# EAGLE design bpf-L-band-BPF-F1250+ (EAGLE 9.2.2)
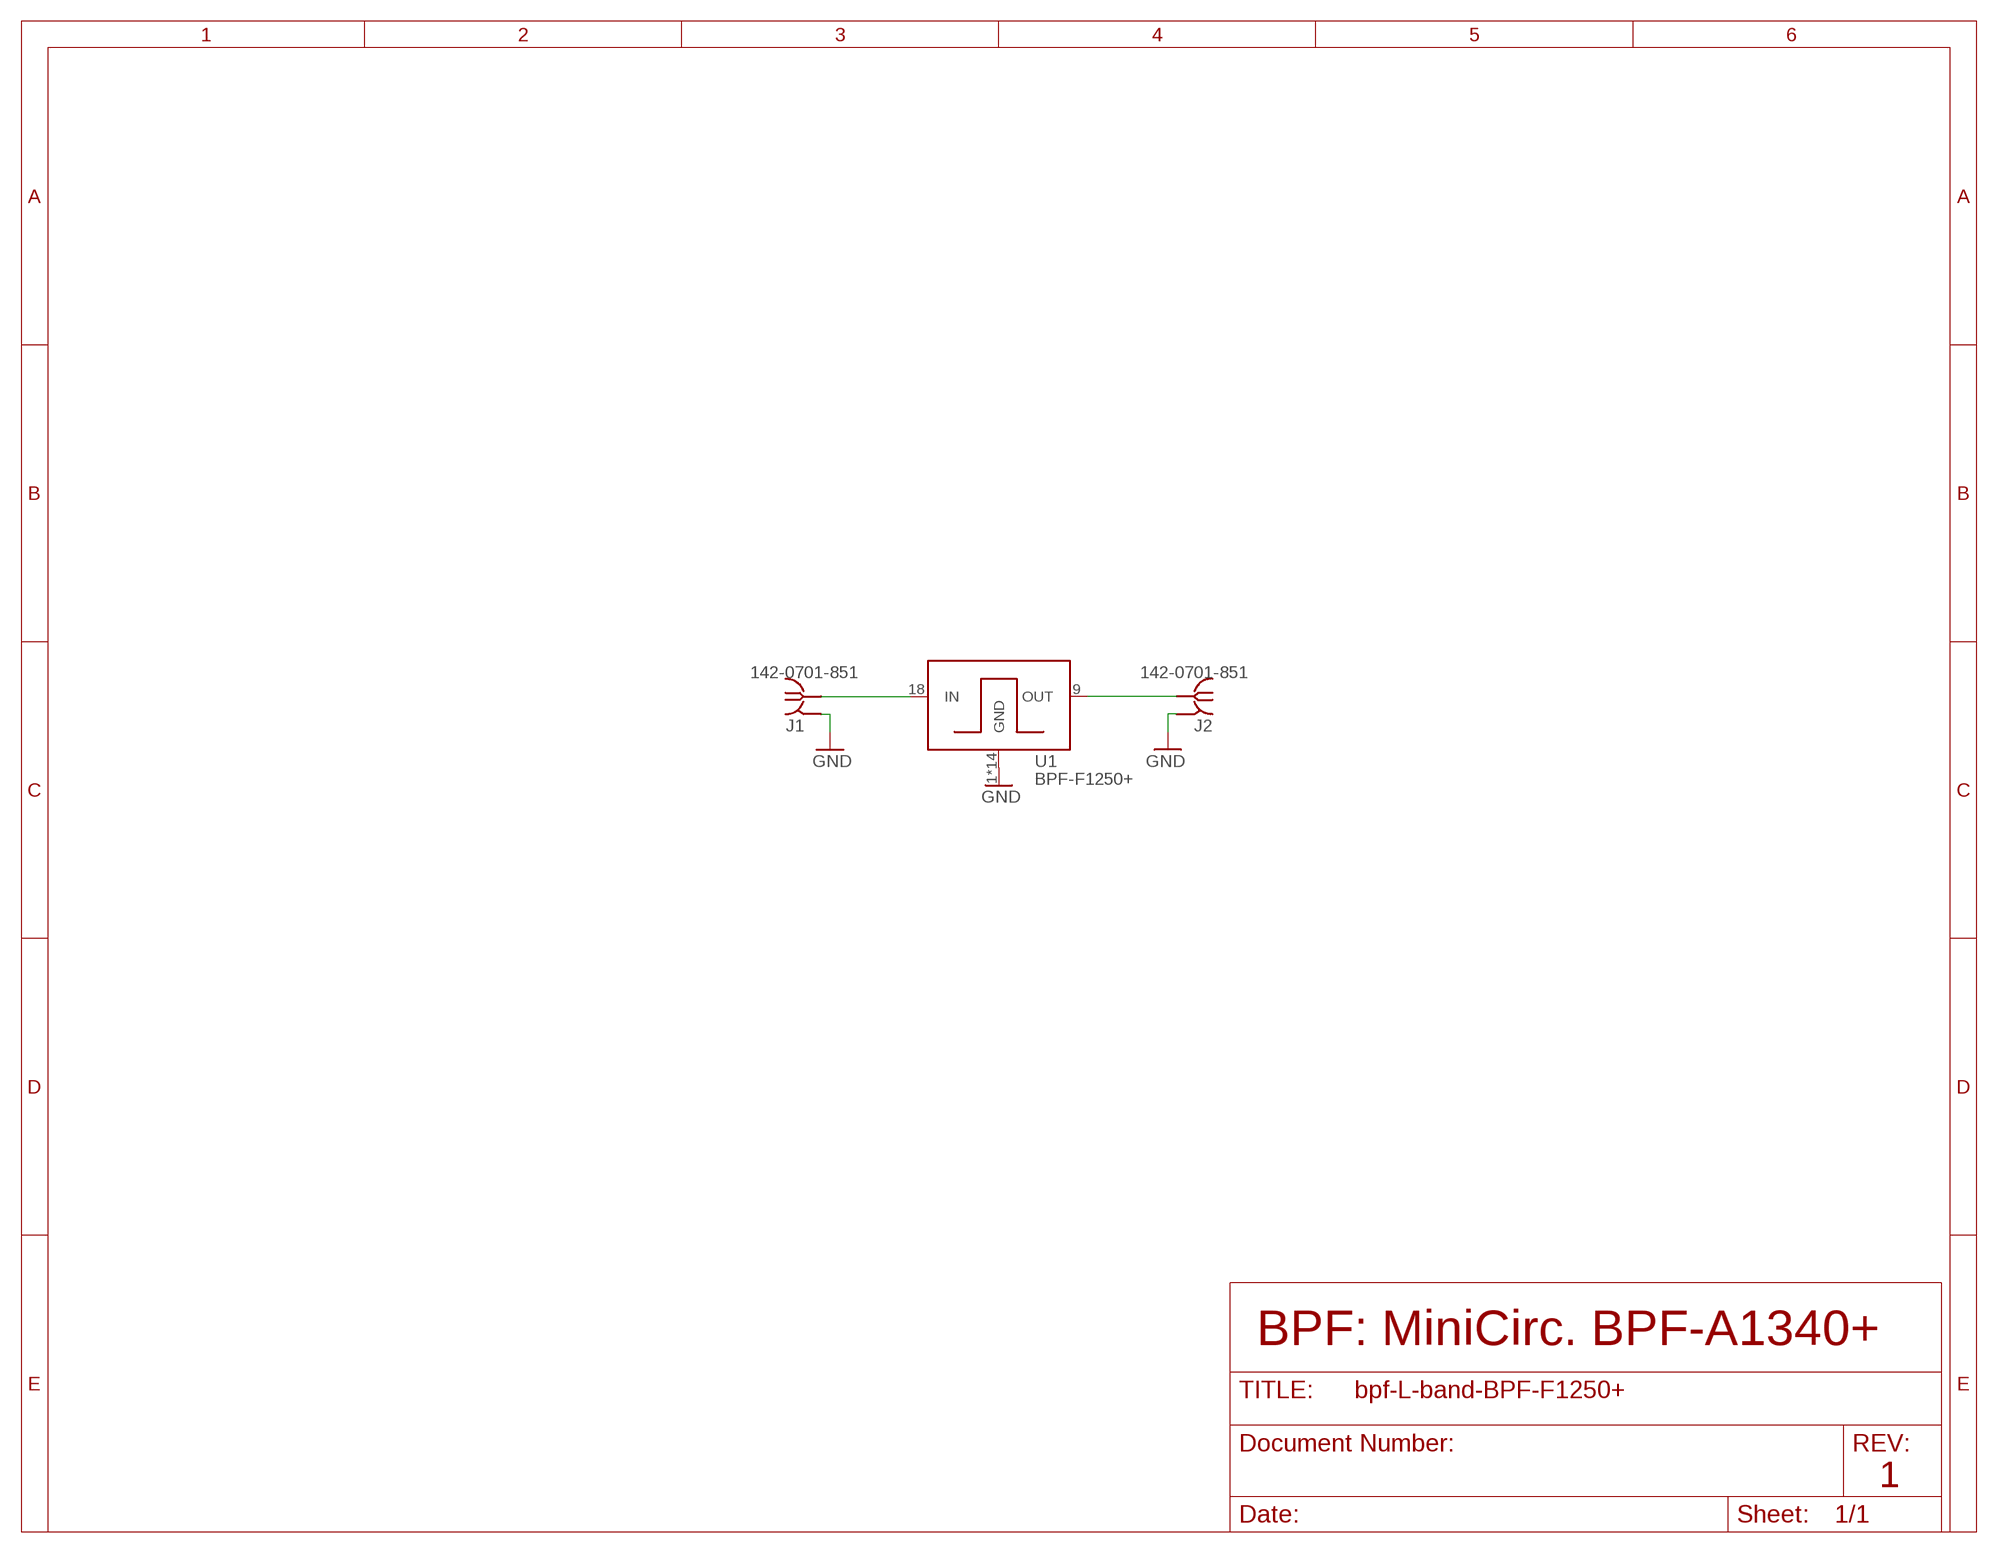
[diagram p0: schematic, sheet 1]

## Parts
J1  142-0701-851  [142-0701-851]
J2  142-0701-851  [142-0701-851]
U1  BPF-F1250+  [BPF-F1250+]

## Nets
GND: J1.GND1(GND) J1.GND2(GND) J1.GND3(GND) J1.GND4(GND) J2.GND1(GND) J2.GND2(GND) J2.GND3(GND) J2.GND4(GND) U1.1(GND) U1.3(GND) U1.4(GND) U1.5(GND) U1.6(GND) U1.7(GND) U1.8(GND) U1.10(GND) U1.12(GND) U1.13(GND) U1.14(GND) U1.15(GND) U1.16(GND) U1.17(GND)
RF-IN [RF]: J1.RF1(RF) U1.18(IN)
RF-OUT [RF]: J2.RF1(RF) U1.9(OUT)

## Notes on the sheet
- BPF: MiniCirc. BPF-A1340+
- 1

## Library data of the parts
J1 J2 = J-Cinch-142-0701-851-SMA-end-launch:142-0701-851: SMA Jack 50Ω - End Launch Source: Datasheet <https://belfuse.com/resources/productinformations/cinchconnectivitysolutions/johnson/pi-ccs-john-142-0701-851.pdf>
U1 = U-MiniCirc-BPF-F1250+-BPF:BPF-F1250+: Bandpass Filter Band: 1050 to 1450 MHz Source: Datasheet <https://www.minicircuits.com/pdfs/BPF-F1250+.pdf>

## Net classes
1 RF: clearance 0.31 mm

## Board
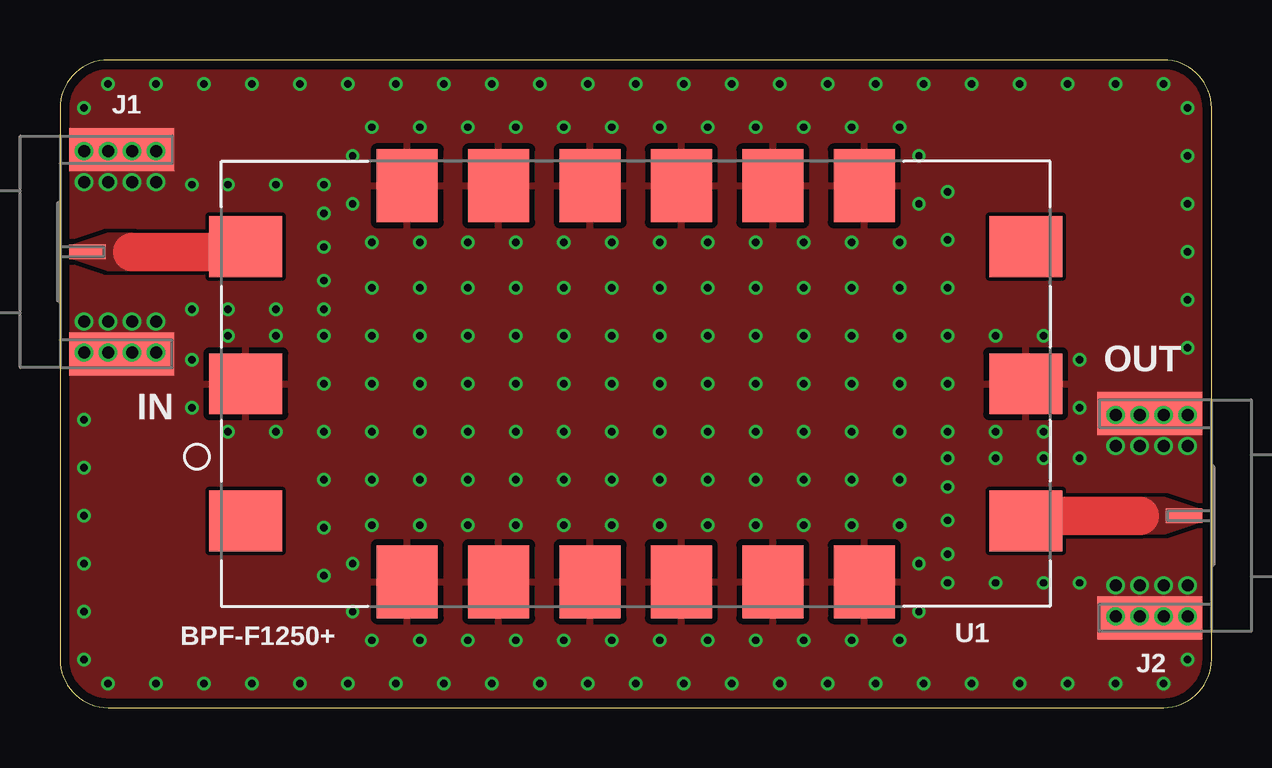
[diagram p1: board, top side]
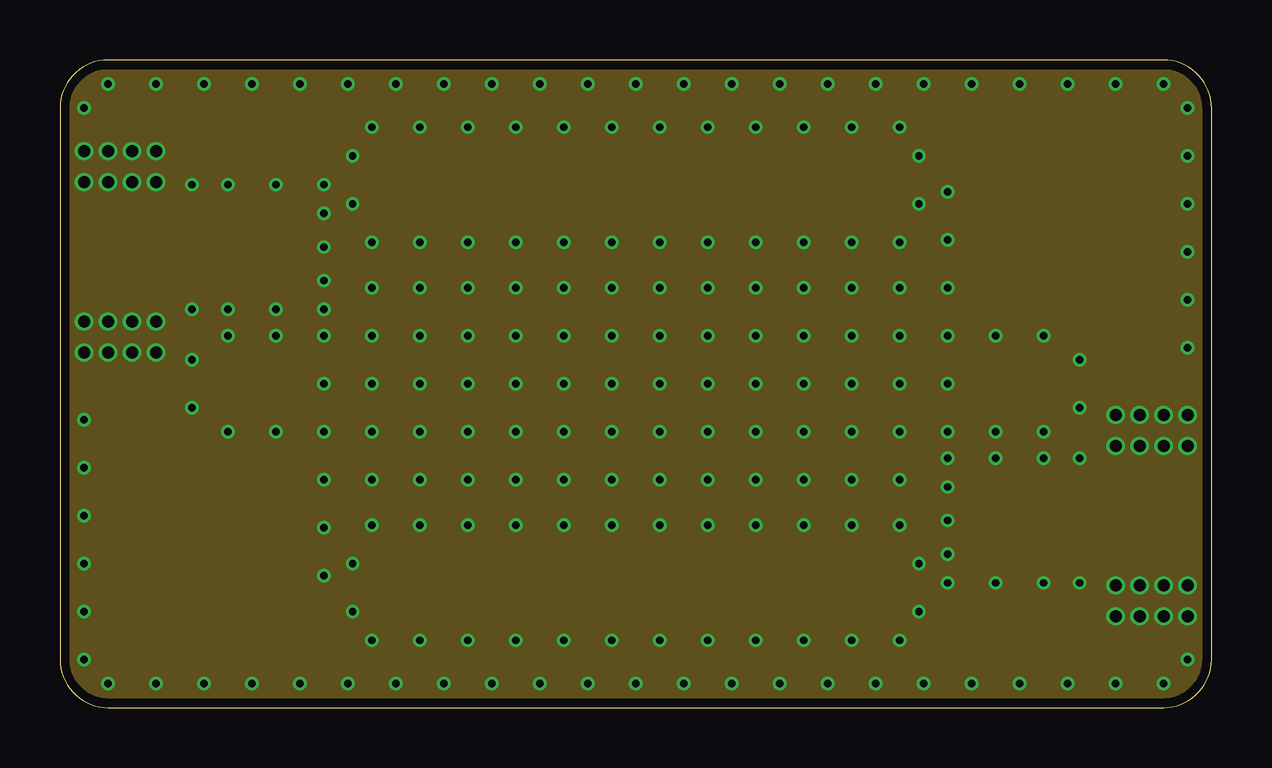
[diagram p2: board, inner layer Route2]
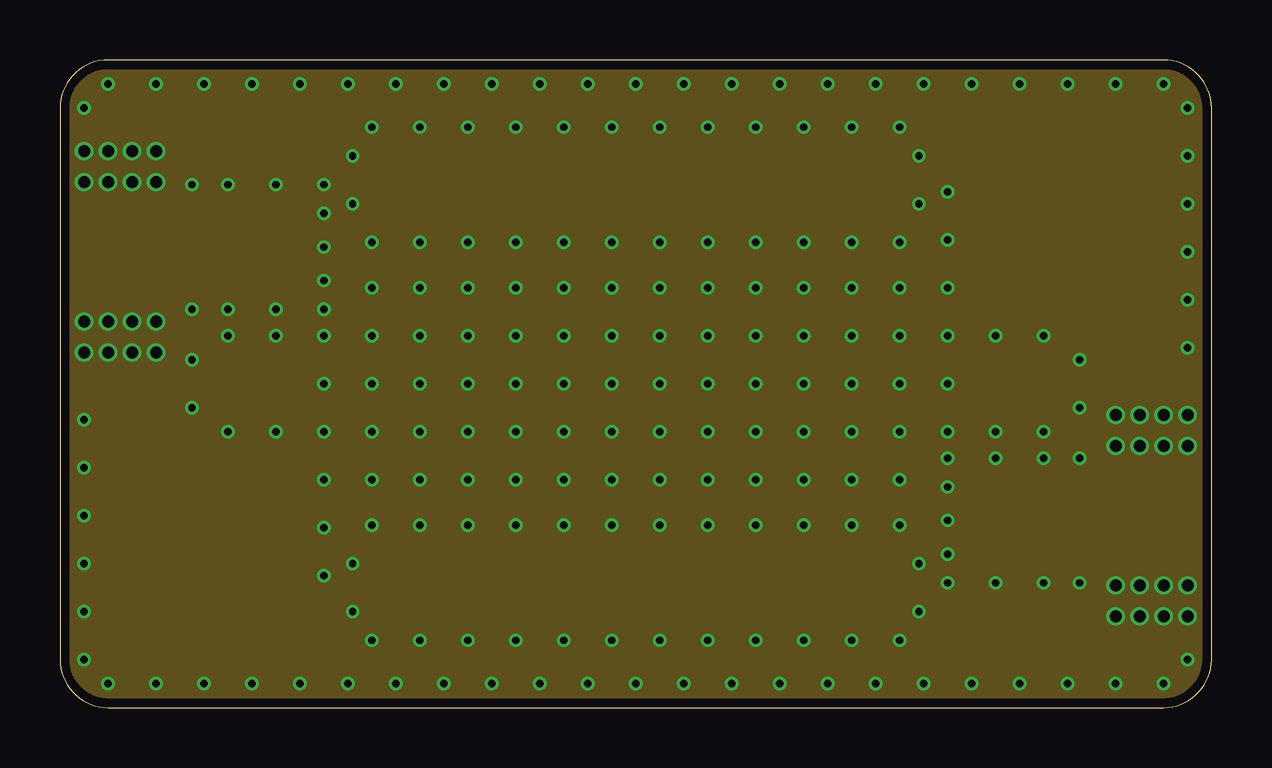
[diagram p3: board, inner layer Route15]
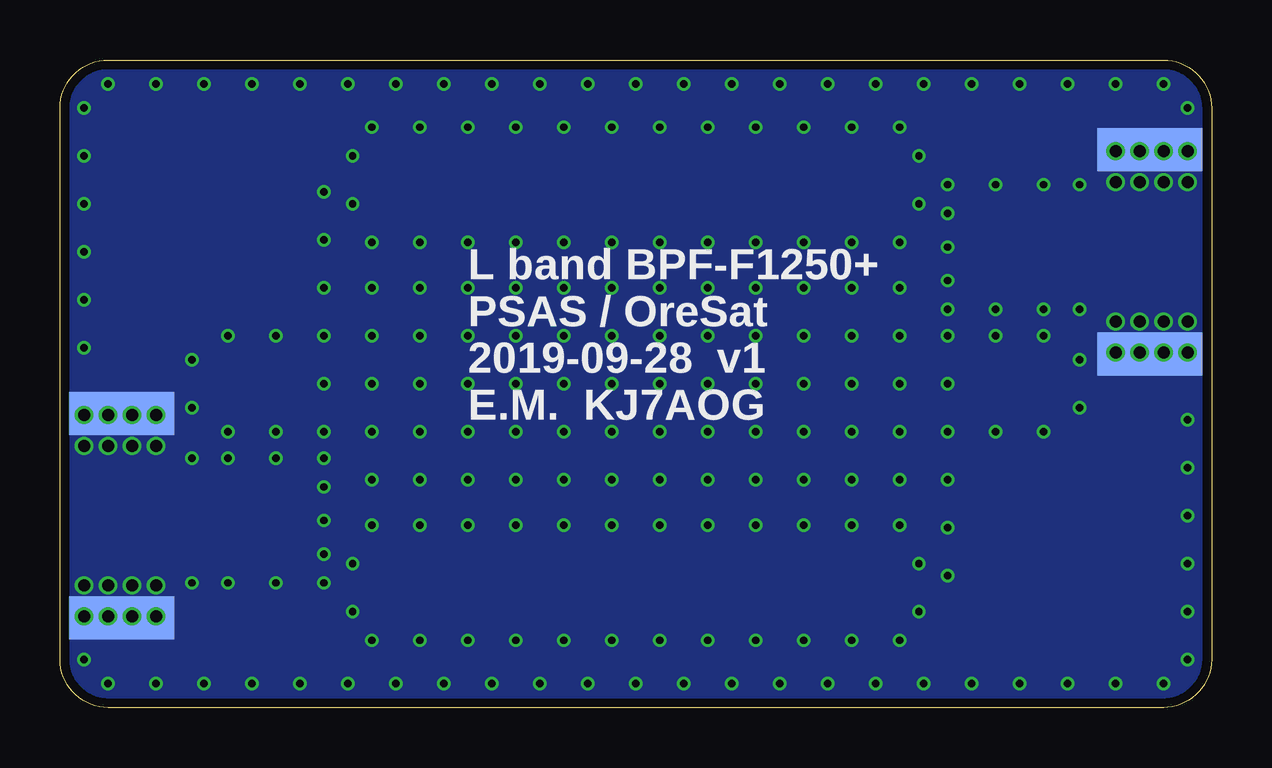
[diagram p4: board, bottom side, seen from below]

Size 48 x 27 mm. Coordinates in mm from the lower left corner, seen from the top.
Outline: 46,27 2,27 arc90 0,25 0,2 arc90 2,0 46,0 arc90 48,2 48,25 arc90 46,27
Copper layers (1*16): Top 0.035559375mm / dielectric 1.6mm / Bottom 0.035559375mm
Design rules "oshpark-2layer-tented": minimum track width 6mil, minimum drill 10mil, track to track 6mil, track to pad 6mil, pad to pad 6mil, via to via 6mil, smd to smd 6mil, copper to edge 15mil, drill to drill 6mil, minimum pad ring 5mil, minimum via ring 5mil, stop-mask expansion 2.5mil, vias tented up to drill 20mil, thermal gap 10mil

### Footprints (pad centres in the part's own frame; a part is rotated, then mirrored left to right if it is on the bottom)
142-0701-851 = smd 1.8 x 4.37: GND1 -4.255,-2.566; GND2 4.255,-2.566 | smd 1.8 x 4.37 bottom: GND3 -4.255,-2.566; GND4 4.255,-2.566 | smd 0.6 x 1.53: RF1 0,-1.146
BPF-F1250+ = smd 3.048 x 2.54: 1 -16.256,0; 2 -16.256,-5.715; 9 16.256,-5.715; 10 16.256,0; 11 16.256,5.715; 18 -16.256,5.715 | smd 2.54 x 3.048: 3 -9.525,-8.255; 4 -5.715,-8.255; 5 -1.905,-8.255; 6 1.905,-8.255; 7 5.715,-8.255; 8 9.525,-8.255; 12 9.525,8.255; 13 5.715,8.255; 14 1.905,8.255; 15 -1.905,8.255; 16 -5.715,8.255; 17 -9.525,8.255

### Placement (x,y rotation side)
J1  0,19 90 top
J2  48,8 270 top
U1  24,13.5 0 top

### Tracks (layer width: path | path; a pad name or v marks a point on that pad's centre or on a via)
GND  (via drill 0.3, 0.5)
  other vias: 1,14.8 2,14.8 3,14.8 4,14.8 1,16.1 2,16.1 3,16.1 4,16.1 1,23.2 2,23.2 3,23.2 4,23.2 1,21.9 2,21.9 3,21.9 4,21.9 44,3.8 45,3.8 46,3.8 47,3.8 47,5.1 46,5.1 45,5.1 44,5.1 44,12.2 45,12.2 46,12.2 47,12.2 44,10.9 45,10.9 46,10.9 47,10.9 1,2 2,1 4,1 44,1 46,1 47,2 1,25 2,26 4,26 44,26 46,26 47,25 11,19.2 11,20.6 11,17.8 37,9.2 37,7.8 37,6.4 9,21.8 11,21.8 7,21.8 5.5,21.8 7,16.6 9,16.6 11,16.6 37,10.4 39,10.4 41,10.4 42.5,10.4 37,5.2 39,5.2 41,5.2 42.5,5.2 5.5,16.6 13,2.8 15,2.8 17,2.8 19,2.8 21,2.8 23,2.8 25,2.8 27,2.8 29,2.8 31,2.8 33,2.8 35,2.8 35,24.2 33,24.2 31,24.2 29,24.2 27,24.2 25,24.2 23,24.2 21,24.2 19,24.2 17,24.2 15,24.2 13,24.2 6,26 8,26 10,26 12,26 14,26 16,26 18,26 42,26 40,26 38,26 36,26 34,26 32,26 30,26 28,26 26,26 24,26 22,26 20,26 6,1 8,1 10,1 12,1 14,1 16,1 18,1 20,1 22,1 24,1 26,1 28,1 30,1 32,1 34,1 36,1 38,1 40,1 42,1 1,4 1,6 1,8 1,10 1,12 47,23 47,21 47,19 47,17 47,15 13,7.6 15,7.6 17,7.6 19,7.6 21,7.6 23,7.6 25,7.6 27,7.6 29,7.6 31,7.6 33,7.6 35,7.6 35,19.4 33,19.4 31,19.4 29,19.4 27,19.4 25,19.4 23,19.4 21,19.4 19,19.4 17,19.4 15,19.4 13,19.4 12.2,23 12.2,21 35.8,23 35.8,21 35.8,6 35.8,4 12.2,6 12.2,4 35,15.5 33,15.5 31,15.5 29,15.5 27,15.5 25,15.5 23,15.5 21,15.5 19,15.5 17,15.5 15,15.5 13,15.5 35,17.5 33,17.5 31,17.5 29,17.5 27,17.5 25,17.5 23,17.5 21,17.5 19,17.5 17,17.5 15,17.5 13,17.5 35,11.5 33,11.5 31,11.5 29,11.5 27,11.5 25,11.5 23,11.5 21,11.5 19,11.5 17,11.5 15,11.5 13,11.5 35,13.5 33,13.5 31,13.5 29,13.5 27,13.5 25,13.5 23,13.5 21,13.5 19,13.5 17,13.5 15,13.5 13,13.5 35,9.5 33,9.5 31,9.5 29,9.5 27,9.5 25,9.5 23,9.5 21,9.5 19,9.5 17,9.5 15,9.5 13,9.5 11,15.5 11,13.5 11,11.5 11,9.5 11,7.5 37,11.5 37,13.5 37,15.5 37,17.5 37,19.5 11,5.5 37,21.5 9,11.5 7,11.5 9,15.5 7,15.5 39,15.5 41,15.5 39,11.5 41,11.5 42.5,14.5 42.5,12.5 5.5,14.5 5.5,12.5
  pour Top (rank 2): 0,27 48,27 48,0 0,0
  pour Top (rank 2, no thermals): 0,24.5 5,24.5 5,13.5 0,13.5
  pour Top (rank 2, no thermals): 43,13.5 48,13.5 48,2.5 43,2.5
  pour Bottom: 0,27 48,27 48,0 0,0
  pour Route15: 0,27 48,27 48,0 0,0
  pour Route2: 0,27 48,27 48,0 0,0
  pour Bottom (no thermals): 0,24.5 5,24.5 5,13.5 0,13.5
  pour Bottom (no thermals): 43,13.5 48,13.5 48,2.5 43,2.5
RF-IN
  Top 0.39: 7.53,19 U1.18
  Top 1.6: U1.18 7.53,19 3,19
  pour Top (no thermals): 3,19.7 2,19.7 0.5,19.2 0.5,18.8 2,18.3 3,18.3
RF-OUT
  Top 0.39: 40.47,8 U1.9
  Top 1.6: U1.9 40.47,8 45,8
  pour Top (no thermals): 45,8.7 46,8.7 47.5,8.2 47.5,7.8 46,7.3 45,7.3

### Text on the board
tPlace: OUT | IN | BPF-F1250+
bPlace: L band BPF-F1250+ / PSAS / OreSat / 2019-09-28 v1 / E.M. KJ7AOG